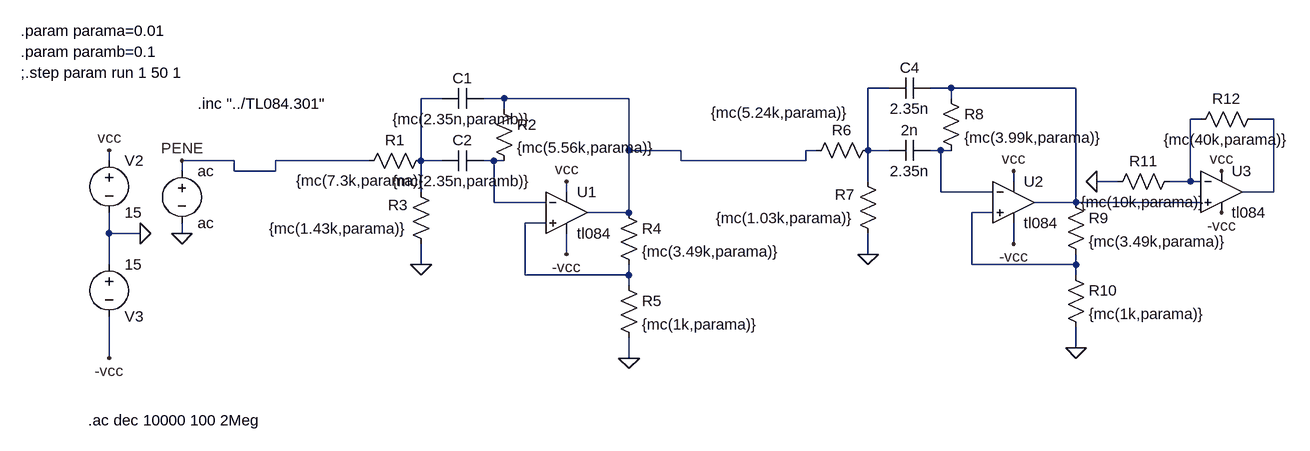
[diagram p0: schematic Celda Sedra sin pote.asc]
Celda Sedra sin pote.asc, the LTspice schematic file:
Version 4
SHEET 1 1648 680
WIRE 1024 -80 992 -80
WIRE 1120 -80 1088 -80
WIRE 1312 -80 1120 -80
WIRE 336 -64 304 -64
WIRE 432 -64 400 -64
WIRE 624 -64 432 -64
WIRE 1120 -64 1120 -80
WIRE 432 -48 432 -64
WIRE 1504 -32 1488 -32
WIRE 1616 -32 1584 -32
WIRE 624 16 624 -64
WIRE 704 16 624 16
WIRE 912 16 896 16
WIRE 992 16 992 -80
WIRE 1024 16 992 16
WIRE 1104 16 1088 16
WIRE 1120 16 1104 16
WIRE -176 32 -176 16
WIRE 16 32 -64 32
WIRE 224 32 80 32
WIRE 304 32 304 -64
WIRE 336 32 304 32
WIRE 416 32 400 32
WIRE 432 32 416 32
WIRE 704 32 704 16
WIRE 896 32 896 16
WIRE 896 32 704 32
WIRE -64 48 -64 32
WIRE 16 48 16 32
WIRE 80 48 80 32
WIRE 80 48 16 48
WIRE 992 64 992 16
WIRE 1216 64 1216 48
WIRE 1376 64 1344 64
WIRE 1488 64 1488 -32
WIRE 1488 64 1456 64
WIRE 1504 64 1488 64
WIRE 304 80 304 32
WIRE 528 80 528 64
WIRE 1104 80 1104 16
WIRE 1184 80 1104 80
WIRE 1616 80 1616 -32
WIRE 1616 80 1568 80
WIRE 416 96 416 32
WIRE 496 96 416 96
WIRE 1312 96 1312 -80
WIRE 1312 96 1248 96
WIRE 1504 96 1312 96
WIRE 624 112 624 16
WIRE 624 112 560 112
WIRE 1184 112 1152 112
WIRE 496 128 464 128
WIRE -176 144 -176 112
WIRE -128 144 -176 144
WIRE -64 144 -64 128
WIRE 1216 160 1216 128
WIRE 528 176 528 144
WIRE 992 176 992 144
WIRE -176 192 -176 144
WIRE 304 192 304 160
WIRE 1152 192 1152 112
WIRE 1312 192 1312 176
WIRE 1312 192 1152 192
WIRE 464 208 464 128
WIRE 624 208 624 192
WIRE 624 208 464 208
WIRE 1312 208 1312 192
WIRE 624 224 624 208
WIRE 1312 320 1312 288
WIRE -176 336 -176 272
WIRE 624 336 624 304
FLAG -128 144 0
FLAG -176 16 vcc
FLAG -176 336 -vcc
FLAG 528 64 vcc
FLAG 528 176 -vcc
FLAG -64 144 0
FLAG 624 336 0
FLAG 304 192 0
FLAG -64 32 PENE
FLAG 1216 48 vcc
FLAG 1216 160 -vcc
FLAG 1312 320 0
FLAG 992 176 0
FLAG 1536 48 vcc
FLAG 1536 112 -vcc
FLAG 1344 64 0
SYMBOL Opamps\\opamp2 528 48 R0
SYMATTR InstName U1
SYMATTR Value tl084
SYMBOL voltage -176 16 R0
WINDOW 123 0 0 Left 0
WINDOW 39 0 0 Left 0
SYMATTR InstName V2
SYMATTR Value 15
SYMBOL voltage -176 176 R0
WINDOW 0 24 96 Left 2
WINDOW 3 24 16 Left 2
WINDOW 123 0 0 Left 0
WINDOW 39 0 0 Left 0
SYMATTR InstName V3
SYMATTR Value 15
SYMBOL voltage -64 32 R0
WINDOW 123 0 0 Left 0
WINDOW 39 0 0 Left 0
SYMATTR InstName ac
SYMATTR Value ac
SYMBOL res 320 16 R90
WINDOW 0 0 56 VBottom 2
WINDOW 3 31 108 VTop 2
SYMATTR InstName R1
SYMATTR Value {mc(7.3k,parama)}
SYMBOL res 320 176 R180
WINDOW 0 36 76 Left 2
WINDOW 3 36 40 Left 2
SYMATTR InstName R3
SYMATTR Value {mc(1.43k,parama)}
SYMBOL cap 400 16 R90
WINDOW 0 0 32 VBottom 2
WINDOW 3 32 32 VTop 2
SYMATTR InstName C2
SYMATTR Value {mc(2.35n,paramb)}
SYMBOL res 416 -64 R0
SYMATTR InstName R2
SYMATTR Value {mc(5.56k,parama)}
SYMBOL cap 400 -80 R90
WINDOW 0 0 32 VBottom 2
WINDOW 3 32 32 VTop 2
SYMATTR InstName C1
SYMATTR Value {mc(2.35n,paramb)}
SYMBOL res 608 96 R0
SYMATTR InstName R4
SYMATTR Value {mc(3.49k,parama)}
SYMBOL res 608 208 R0
SYMATTR InstName R5
SYMATTR Value {mc(1k,parama)}
SYMBOL Opamps\\opamp2 1216 32 R0
SYMATTR InstName U2
SYMATTR Value tl084
SYMBOL res 1008 0 R90
WINDOW 0 0 56 VBottom 2
WINDOW 3 -58 151 VTop 2
SYMATTR InstName R6
SYMATTR Value {mc(5.24k,parama)}
SYMBOL res 1008 160 R180
WINDOW 0 36 76 Left 2
WINDOW 3 36 40 Left 2
SYMATTR InstName R7
SYMATTR Value {mc(1.03k,parama)}
SYMBOL cap 1088 0 R90
WINDOW 0 0 32 VBottom 2
WINDOW 3 32 32 VTop 2
SYMATTR InstName 2n
SYMATTR Value 2.35n
SYMBOL res 1104 -80 R0
SYMATTR InstName R8
SYMATTR Value {mc(3.99k,parama)}
SYMBOL cap 1088 -96 R90
WINDOW 0 0 32 VBottom 2
WINDOW 3 32 32 VTop 2
SYMATTR InstName C4
SYMATTR Value 2.35n
SYMBOL res 1296 80 R0
SYMATTR InstName R9
SYMATTR Value {mc(3.49k,parama)}
SYMBOL res 1296 192 R0
SYMATTR InstName R10
SYMATTR Value {mc(1k,parama)}
SYMBOL Opamps\\opamp2 1536 16 R0
SYMATTR InstName U3
SYMATTR Value tl084
SYMBOL res 1472 48 R90
WINDOW 0 0 56 VBottom 2
WINDOW 3 32 56 VTop 2
SYMATTR InstName R11
SYMATTR Value {mc(10k,parama)}
SYMBOL res 1600 -48 R90
WINDOW 0 0 56 VBottom 2
WINDOW 3 32 56 VTop 2
SYMATTR InstName R12
SYMATTR Value {mc(40k,parama)}
TEXT -208 432 Left 2 !.ac dec 10000 100 2Meg
TEXT -312 -168 Left 2 !.param parama=0.01
TEXT -312 -136 Left 2 !.param paramb=0.1
TEXT -312 -104 Left 2 !;.step param run 1 50 1
TEXT -40 -56 Left 2 !.inc "../TL084.301"

The netlist it stands for:
* Celda Sedra sin pote.asc
XU1 N010 N008 vcc -vcc N004 tl084  ; pins In+ In- V+ V- OUT
V2 vcc 0 15
V3 0 -vcc 15
V§ac PENE 0 ac
R1 N003 PENE {mc(7.3k,parama)}
R3 0 N003 {mc(1.43k,parama)}
C2 N008 N003 {mc(2.35n,paramb)}
R2 N004 N008 {mc(5.56k,parama)}
C1 N004 N003 {mc(2.35n,paramb)}
R4 N004 N010 {mc(3.49k,parama)}
R5 N010 0 {mc(1k,parama)}
XU2 N009 N007 vcc -vcc N002 tl084  ; pins In+ In- V+ V- OUT
R6 N001 N004 {mc(5.24k,parama)}
R7 0 N001 {mc(1.03k,parama)}
C§2n N007 N001 2.35n
R8 N002 N007 {mc(3.99k,parama)}
C4 N002 N001 2.35n
R9 N002 N009 {mc(3.49k,parama)}
R10 N009 0 {mc(1k,parama)}
XU3 N002 N005 vcc -vcc N006 tl084  ; pins In+ In- V+ V- OUT
R11 N005 0 {mc(10k,parama)}
R12 N006 N005 {mc(40k,parama)}
.ac dec 10000 100 2Meg
.param parama=0.01
.param paramb=0.1
;.step param run 1 50 1
.inc "../TL084.301"
.backanno
.end